# EAGLE design Anzeigetafel (EAGLE 9.6.2)
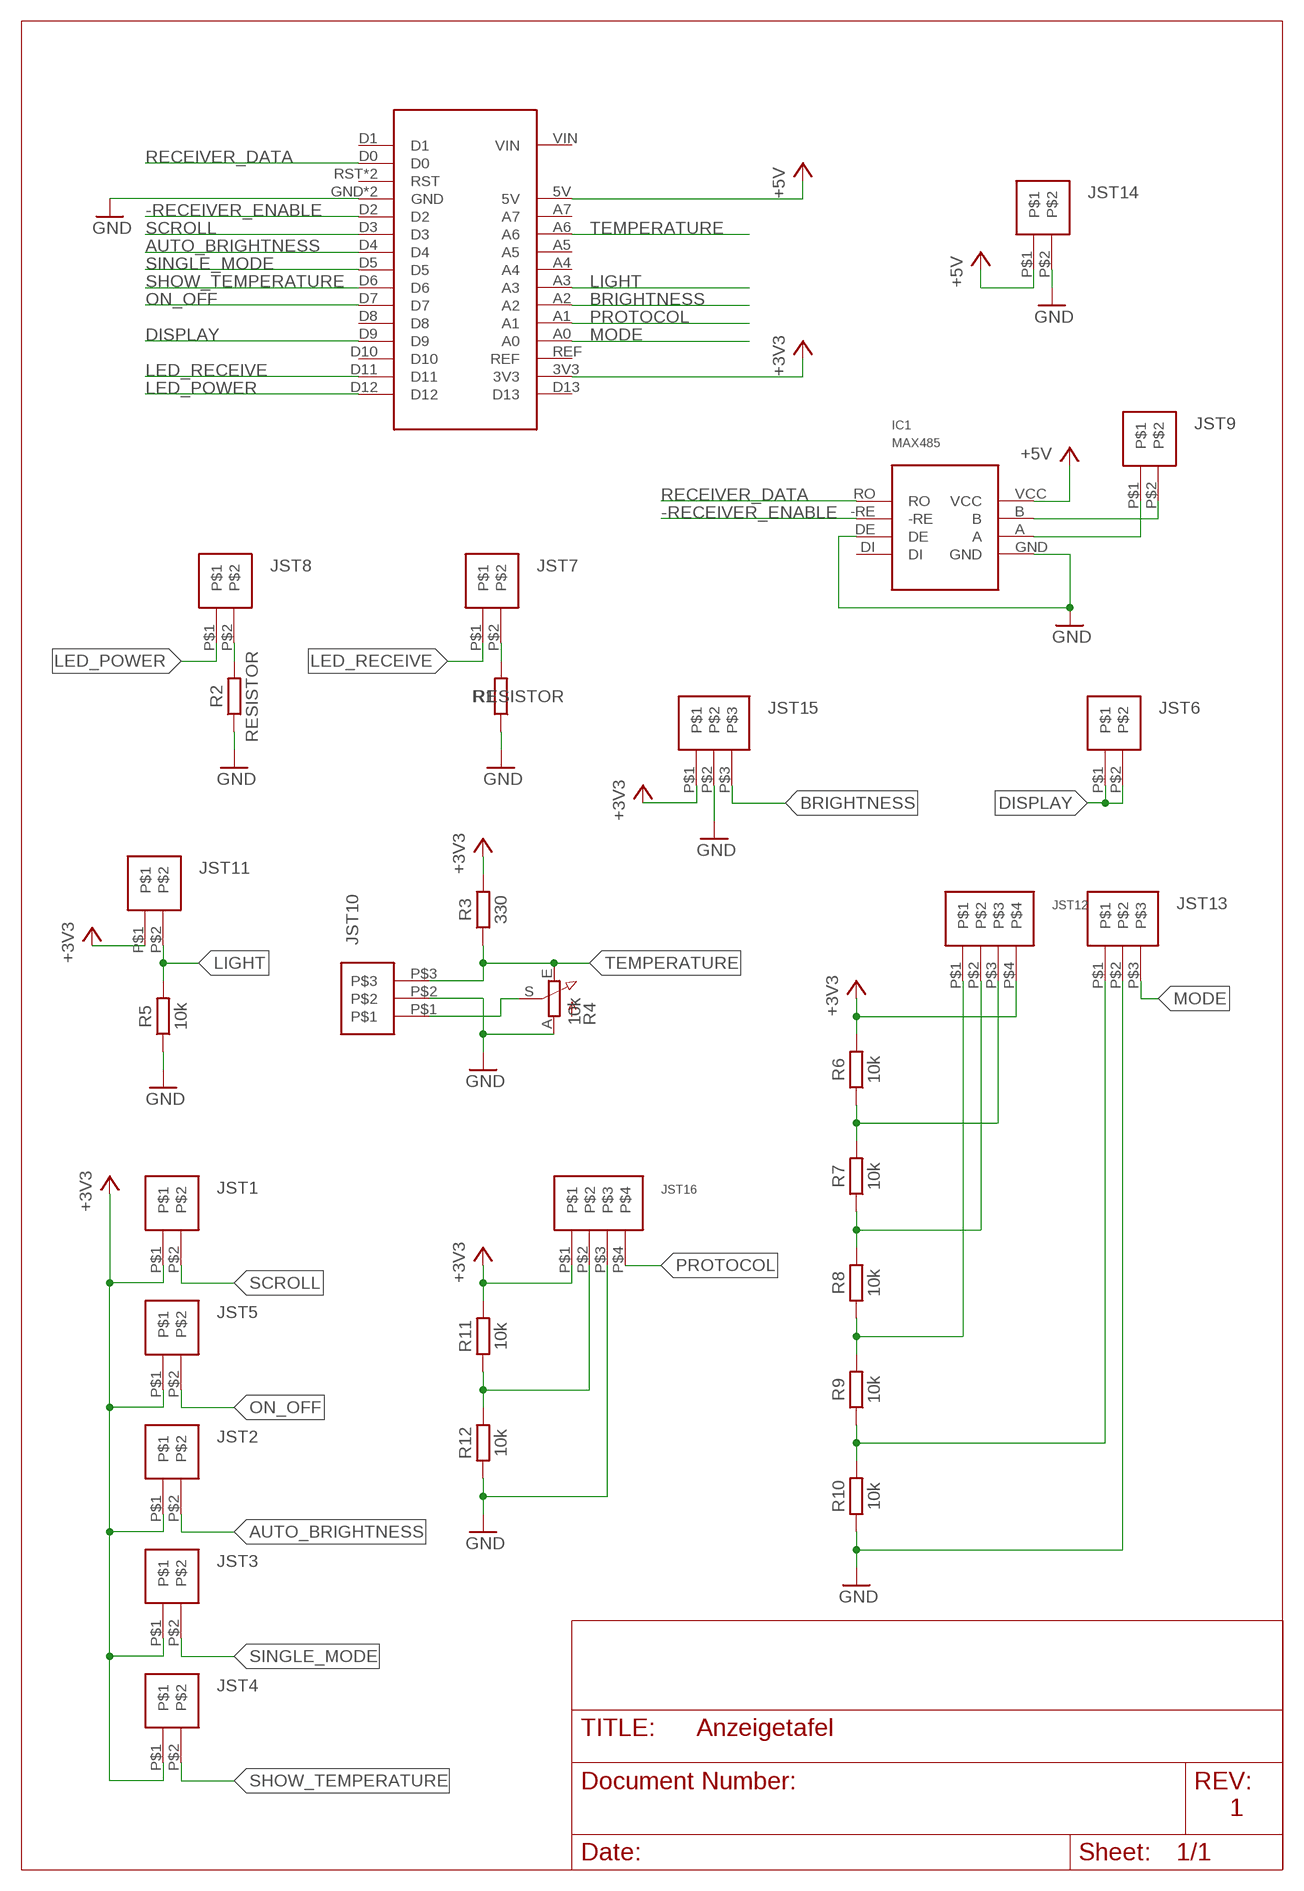
[diagram p0: schematic, sheet 1]

## Parts
IC1  MAX485  [MAX485]
JST1  JST-2  [JST-2]
JST2  JST-2  [JST-2]
JST3  JST-2  [JST-2]
JST4  JST-2  [JST-2]
JST5  JST-2  [JST-2]
JST6  JST-2  [JST-2]
JST7  JST-2  [JST-2]
JST8  JST-2  [JST-2]
JST9  JST-2  [JST-2]
JST10  JST-3  [JST-3]
JST11  JST-2  [JST-2]
JST12  JST-4  [JST-4]
JST13  JST-3  [JST-3]
JST14  JST-2  [JST-2]
JST15  JST-3  [JST-3]
JST16  JST-4  [JST-4]
MCU1  NUCLEO-32G0  [NUCLEO-32G0]
R1  RESISTOR  [0207/7]
R2  RESISTOR  [0207/7]
R3  330  RESISTOR  [0207/7]
R4  10k  POTENTIOMETER  [S64W]
R5  10k  RESISTOR  [0207/7]
R6  10k  RESISTOR  [0207/7]
R7  10k  RESISTOR  [0207/7]
R8  10k  RESISTOR  [0207/7]
R9  10k  RESISTOR  [0207/7]
R10  10k  RESISTOR  [0207/7]
R11  10k  RESISTOR  [0207/7]
R12  10k  RESISTOR  [0207/7]

## Nets
+3V3: JST1.P$1 JST2.P$1 JST3.P$1 JST4.P$1 JST5.P$1 JST11.P$1 JST12.P$4 JST15.P$1 JST16.P$1 MCU1.3V3 R3.2 R6.2 R11.2
+5V: IC1.VCC JST14.P$1 MCU1.5V
-RECEIVER_ENABLE: IC1.-RE MCU1.D2
AUTO_BRIGHTNESS: JST2.P$2 MCU1.D4
BRIGHTNESS: JST15.P$3 MCU1.A2
DISPLAY: JST6.P$1 JST6.P$2 MCU1.D9
GND: IC1.DE IC1.GND JST10.P$2 JST13.P$2 JST14.P$2 JST15.P$2 JST16.P$3 MCU1.GND MCU1.GND1(GND) R1.1 R2.1 R4.A R5.1 R10.1 R12.1
LED_POWER: JST8.P$1 MCU1.D12
LED_RECEIVE: JST7.P$1 MCU1.D11
LIGHT: JST11.P$2 MCU1.A3 R5.2
MODE: JST13.P$3 MCU1.A0
N$2: JST8.P$2 R2.2
N$3: IC1.A JST9.P$1
N$4: JST7.P$2 R1.2
N$5: JST10.P$1 R4.S
N$7: IC1.B JST9.P$2
N$8: JST12.P$3 R6.1 R7.2
N$10: JST12.P$2 R7.1 R8.2
N$11: JST12.P$1 R8.1 R9.2
N$12: JST13.P$1 R9.1 R10.2
N$13: JST16.P$2 R11.1 R12.2
ON_OFF: JST5.P$2 MCU1.D7
PROTOCOL: JST16.P$4 MCU1.A1
RECEIVER_DATA: IC1.RO MCU1.D0
SCROLL: JST1.P$2 MCU1.D3
SHOW_TEMPERATURE: JST4.P$2 MCU1.D6
SINGLE_MODE: JST3.P$2 MCU1.D5
TEMPERATURE: JST10.P$3 MCU1.A6 R3.1 R4.E
Unconnected: IC1.DI MCU1.A4 MCU1.A5 MCU1.A7 MCU1.D1 MCU1.D8 MCU1.D10 MCU1.D13 MCU1.REF MCU1.RST MCU1.RST1(RST) MCU1.VIN

## Notes on the sheet
- 1

## Library data of the parts
IC1 = eigene:MAX485: MAX485 RS-485/RS-422 Transceiver
JST1-JST9 JST11 JST14 = eigene:JST-2: JST Steckverbinder mit 2 Pins.
JST10 JST13 JST15 = eigene:JST-3: JST Steckverbinder mit 3 Pins.
JST12 JST16 = eigene:JST-4: JST Steckverbinder mit 4 Pins.
MCU1 = eigene:NUCLEO-32G0: STM NUCLEO-G031K8 Board mit Arduino Nano Kompabilität
R1-R3 R5-R12 = eigene:RESISTOR
R4 = eigene:POTENTIOMETER

## Board
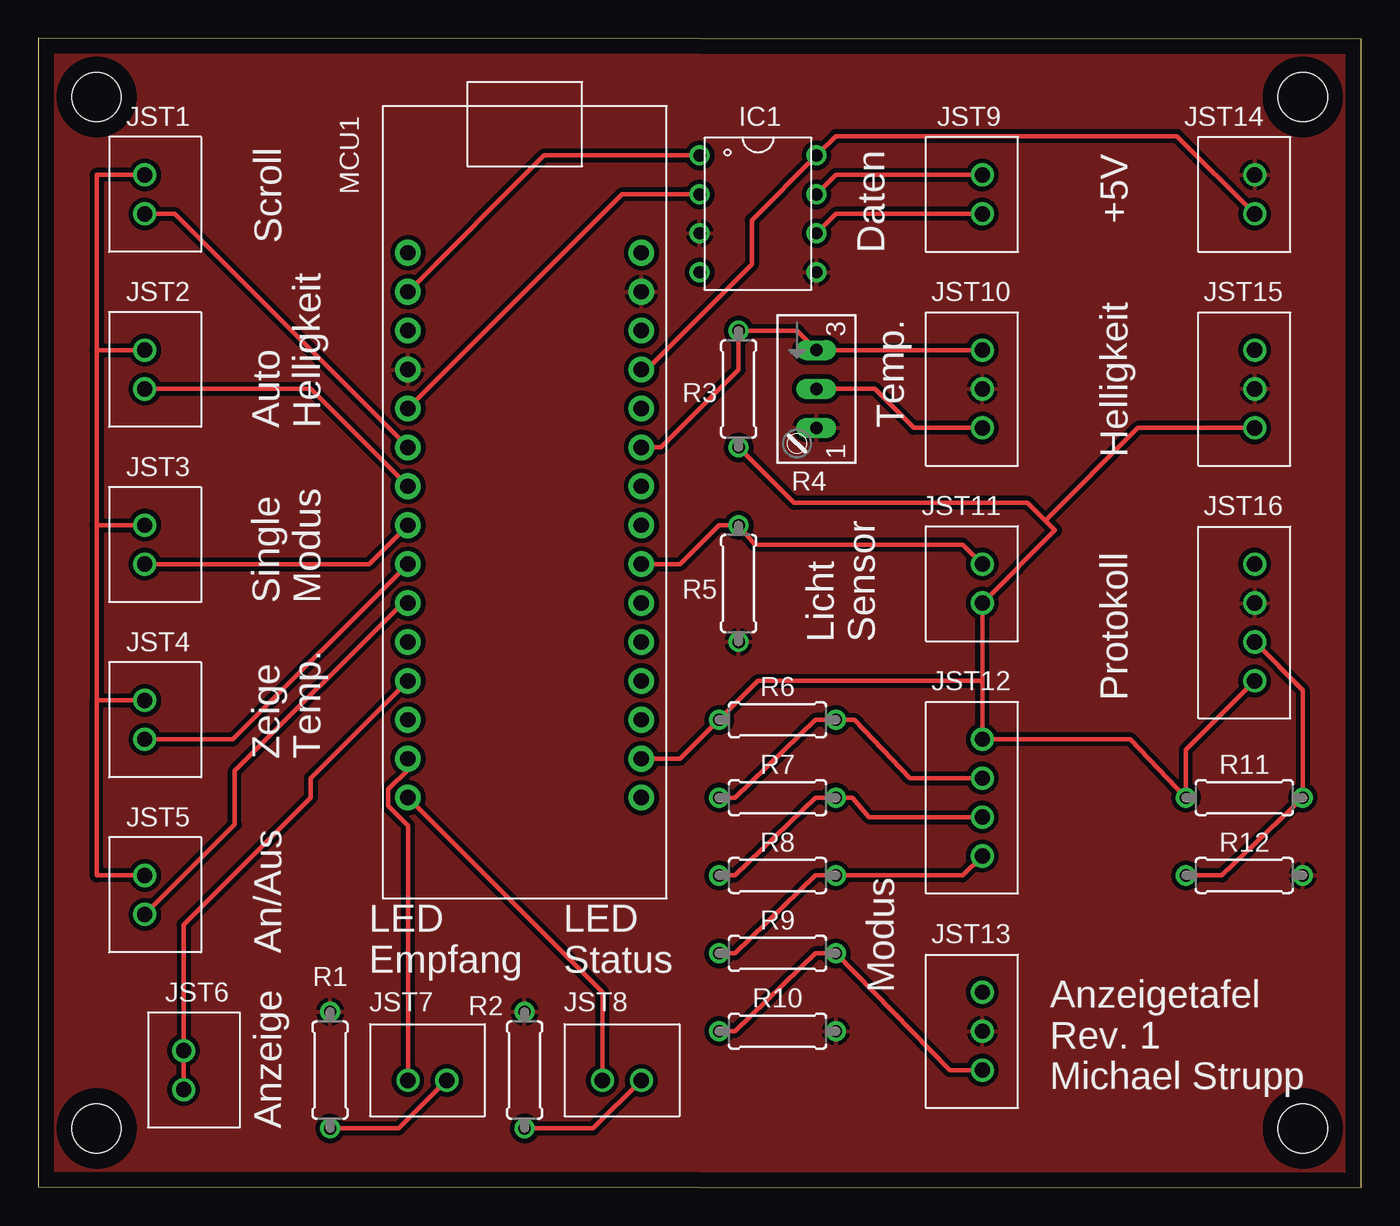
[diagram p1: board, top side]
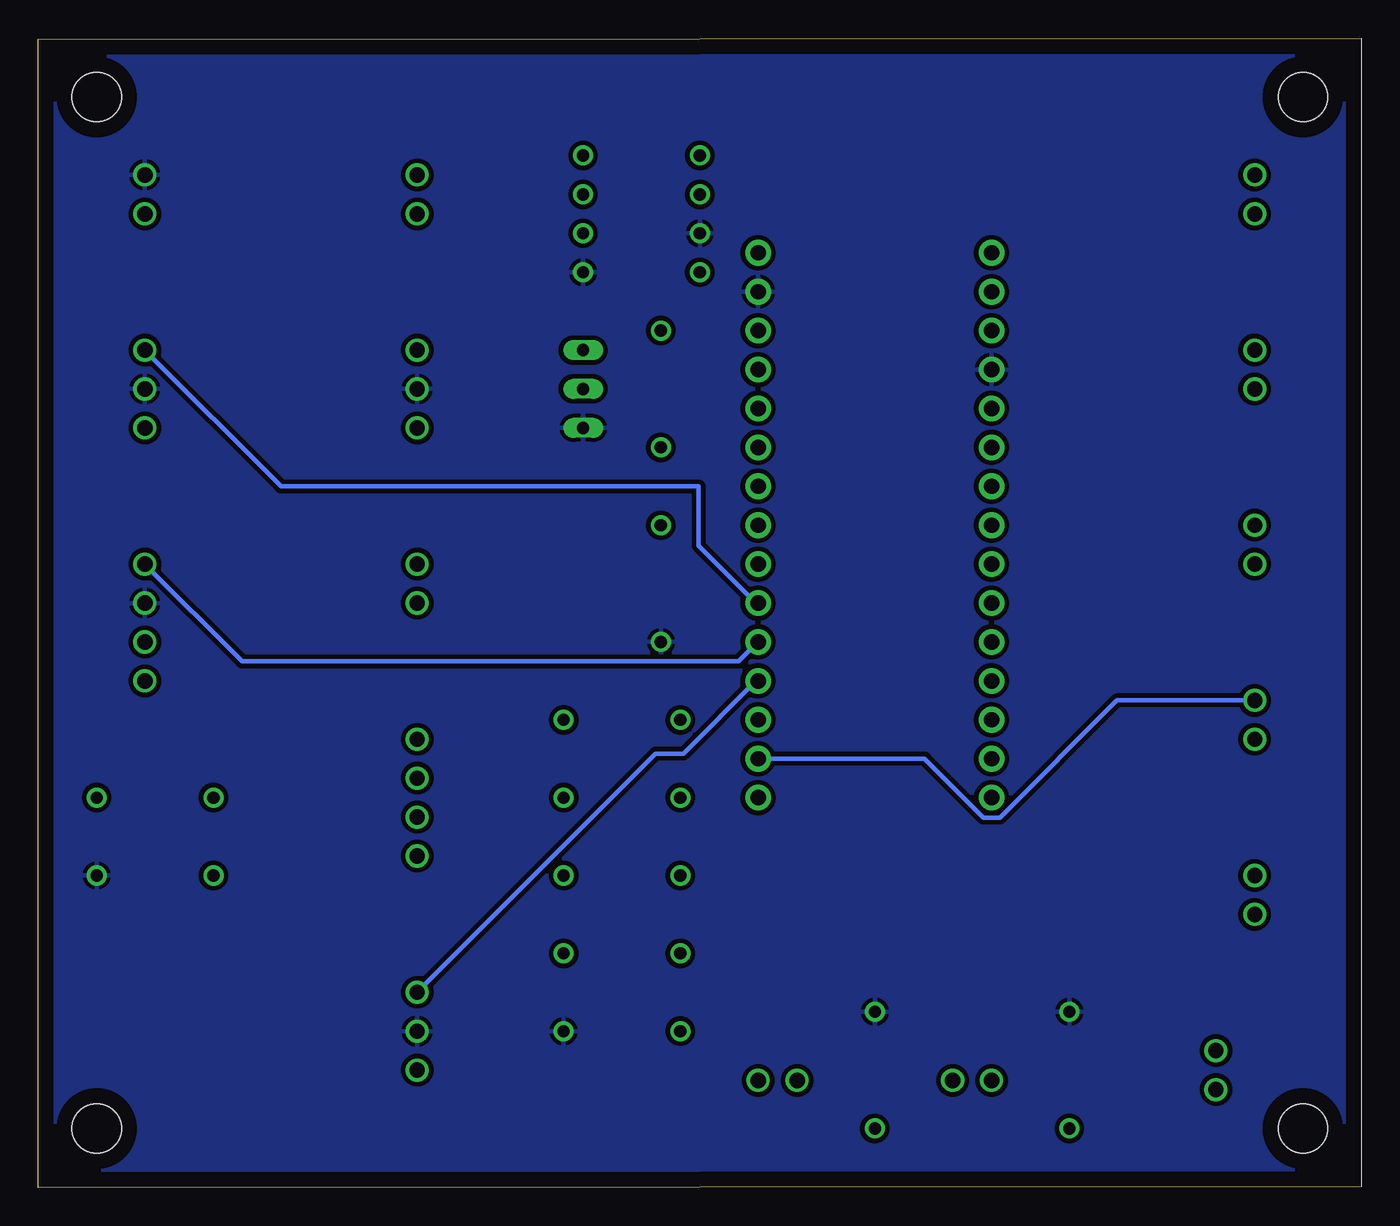
[diagram p2: board, bottom side, seen from below]

Size 86.37 x 75.01 mm. Coordinates in mm from the lower left corner, seen from the top.
Outline: 0,0.05 86.36,0 86.36,74.96 0,75.01 0,0.05
Copper layers (1*16): Top 0.035mm / dielectric 1.5mm / Bottom 0.035mm
Design rules "default *": minimum track width 6mil, minimum drill 0.35mm, track to track 12mil, track to pad 12mil, pad to pad 12mil, via to via 12mil, smd to smd 6mil, copper to edge 40mil, drill to drill 6mil, minimum pad ring 10mil, minimum via ring 8mil, stop-mask expansion 4mil, vias tented up to drill 0mil, thermal gap 10mil
Holes 3.2 mm at 82.55,3.86 82.55,71.17 3.81,71.17 3.81,3.86

### Footprints (pad centres in the part's own frame; a part is rotated, then mirrored left to right if it is on the bottom)
MAX485 = drill 0.8: -RE -3.81,1.27; A 3.81,-1.27; B 3.81,1.27; DE -3.81,-1.27; DI -3.81,-3.81; GND 3.81,-3.81; RO -3.81,3.81; VCC 3.81,3.81
JST-2 = drill 1: P$1 -1.27,-0.67; P$2 1.27,-0.67
JST-3 = drill 1: P$1 -2.54,-0.67; P$2 0,-0.67; P$3 2.54,-0.67
JST-4 = drill 1: P$1 -3.81,-0.67; P$2 -1.27,-0.67; P$3 1.27,-0.67; P$4 3.81,-0.67
NUCLEO-32G0 = drill 1 pad 1.676: 3V3 7.62,-15.24; 5V 7.62,10.16; A0 7.62,-10.16; A1 7.62,-7.62; A2 7.62,-5.08; A3 7.62,-2.54; A4 7.62,0; A5 7.62,2.54; A6 7.62,5.08; A7 7.62,7.62; D0 -7.62,15.24; D1 -7.62,17.78; D2 -7.62,7.62; D3 -7.62,5.08; D4 -7.62,2.54; D5 -7.62,0; D6 -7.62,-2.54; D7 -7.62,-5.08; D8 -7.62,-7.62; D9 -7.62,-10.16; D10 -7.62,-12.7; D11 -7.62,-15.24; D12 -7.62,-17.78; D13 7.62,-17.78; GND -7.62,10.16; GND1 7.62,15.24; REF 7.62,-12.7; RST -7.62,12.7; RST1 7.62,12.7; VIN 7.62,17.78
0207/7 = drill 0.8: 1 -3.81,0; 2 3.81,0
S64W = drill 0.8 long: A 2.54,1.27; E -2.54,1.27; S 0,1.27

### Placement (x,y rotation side)
IC1  46.99,63.55 0 top
JST1  7.62,64.82 270 top
JST2  7.62,53.39 270 top
JST3  7.62,41.96 270 top
JST4  7.62,30.53 270 top
JST5  7.62,19.1 270 top
JST6  10.16,7.67 270 top
JST7  25.4,7.67 0 top
JST8  38.1,7.67 0 top
JST9  60.96,64.82 90 top
JST10  60.96,52.12 90 top
JST11  60.96,39.42 90 top
JST12  60.96,25.45 90 top
JST13  60.96,10.21 90 top
JST14  78.74,64.82 90 top
JST15  78.74,52.12 90 top
JST16  78.74,36.88 90 top
MCU1  31.75,43.23 0 top
R1  19.05,7.67 270 top
R2  31.75,7.67 270 top
R3  45.72,52.12 270 top
R4  49.53,52.12 270 top
R5  45.72,39.42 90 top
R6  48.26,30.53 180 top
R7  48.26,25.45 180 top
R8  48.26,20.37 180 top
R9  48.26,15.29 180 top
R10  48.26,10.21 180 top
R11  78.74,25.45 180 top
R12  78.74,20.37 180 top

### Tracks (layer width: path | path; a pad name or v marks a point on that pad's centre or on a via)
+3V3
  Top 0.305: MCU1.3V3 41.91,27.99 R6.2 46.99,33.07 61.63,33.07 | 61.63,33.07 JST12.P$4 71.31,29.26 R11.2 74.93,28.59 JST16.P$1 | 61.63,33.07 JST11.P$1 66.38,42.9 65.74,43.53 | JST15.P$1 71.79,49.58 65.74,43.53 | R3.2 49.34,44.69 64.58,44.69 65.74,43.53 | JST1.P$1 3.81,66.09 3.81,54.66 | 3.81,54.66 JST2.P$1 | 3.81,54.66 3.81,43.23 | 3.81,43.23 JST3.P$1 | 3.81,43.23 3.81,31.8 | 3.81,31.8 JST4.P$1 | JST5.P$1 3.81,20.37 3.81,31.8
  Bottom 0.305: JST4.P$1 15.95,31.8 23.59,24.16 24.67,24.16 28.5,27.99 MCU1.3V3
+5V
  Top 0.305: JST14.P$1 74.33,68.63 52.07,68.63 IC1.VCC 46.58,63.14 46.58,60.25 39.72,53.39 MCU1.5V
-RECEIVER_ENABLE
  Top 0.305: MCU1.D2 38.1,64.82 IC1.-RE
AUTO_BRIGHTNESS
  Top 0.305: JST2.P$2 17.78,52.12 MCU1.D4
BRIGHTNESS
  Bottom 0.305: JST15.P$3 70.52,45.77 43.25,45.77 43.25,41.89 39.51,38.15 MCU1.A2
DISPLAY
  Top 0.305: MCU1.D9 17.78,26.72 17.78,25.45 9.49,17.16 JST6.P$1 JST6.P$2
GND
  pour Top: -1.27,76.25 -1.27,-1.22 87.63,-1.22 87.63,76.25
  pour Bottom: 0,74.98 0,0.05 86.36,0.05 86.36,74.98
LED_POWER
  Top 0.305: JST8.P$1 36.83,12.75 MCU1.D12
LED_RECEIVE
  Top 0.305: JST7.P$1 24.13,23.62 22.84,24.91 22.84,25.99 24.13,27.28 MCU1.D11
LIGHT
  Top 0.305: JST11.P$2 60.36,41.96 46.8,41.96 R5.2 44.45,43.23 41.91,40.69 MCU1.A3
MODE
  Bottom 0.305: JST13.P$3 46.05,28.33 44.25,28.33 39.51,33.07 MCU1.A0
N$2
  Top 0.305: R2.2 36.23,3.86 JST8.P$2
N$3
  Top 0.305: JST9.P$1 52.07,63.55 IC1.A
N$4
  Top 0.305: R1.2 23.53,3.86 JST7.P$2
N$5
  Top 0.305: JST10.P$1 57.15,49.58 54.61,52.12 R4.S
N$7
  Top 0.305: IC1.B 52.07,66.09 JST9.P$2
N$8
  Top 0.305: R7.2 45.48,25.45 50.75,30.53 R6.1 53.28,30.53 56.9,26.72 JST12.P$3
N$10
  Top 0.305: R8.2 45.48,20.37 50.75,25.45 R7.1 53.15,25.45 54.23,24.18 JST12.P$2
N$11
  Top 0.305: R9.2 45.48,15.29 50.75,20.37 R8.1 60.36,20.37 JST12.P$1
N$12
  Top 0.305: R10.2 45.48,10.21 50.75,15.29 R9.1 59.5,7.67 JST13.P$1
N$13
  Top 0.305: R12.2 77.28,20.37 R11.1 82.55,32.47 JST16.P$2
ON_OFF
  Top 0.305: JST5.P$2 12.83,23.71 12.83,27.19 23.78,38.15 MCU1.D7
PROTOCOL
  Bottom 0.305: MCU1.A1 40.64,34.34 73.06,34.34 JST16.P$4
RECEIVER_DATA
  Top 0.305: MCU1.D0 33.02,67.36 IC1.RO
SCROLL
  Top 0.305: JST1.P$2 8.89,63.55 MCU1.D3
SHOW_TEMPERATURE
  Top 0.305: JST4.P$2 12.7,29.26 MCU1.D6
SINGLE_MODE
  Top 0.305: JST3.P$2 21.59,40.69 MCU1.D5
TEMPERATURE
  Top 0.305: MCU1.A6 40.64,48.31 45.72,53.39 R3.1 49.53,55.93 R4.E JST10.P$3

### Text on the board
tPlace: +5V | Scroll | Daten | Auto / Helligkeit | Temp. | Helligkeit | Single / Modus | Licht / Sensor | Protokoll | Zeige / Temp. | An/Aus | LED / Empfang | LED / Status | Modus | Anzeigetafel / Rev. 1 / Michael Strupp | Anzeige